# Altium project EmbeddedSystem_Project.PrjPcb (part 2 of 2)
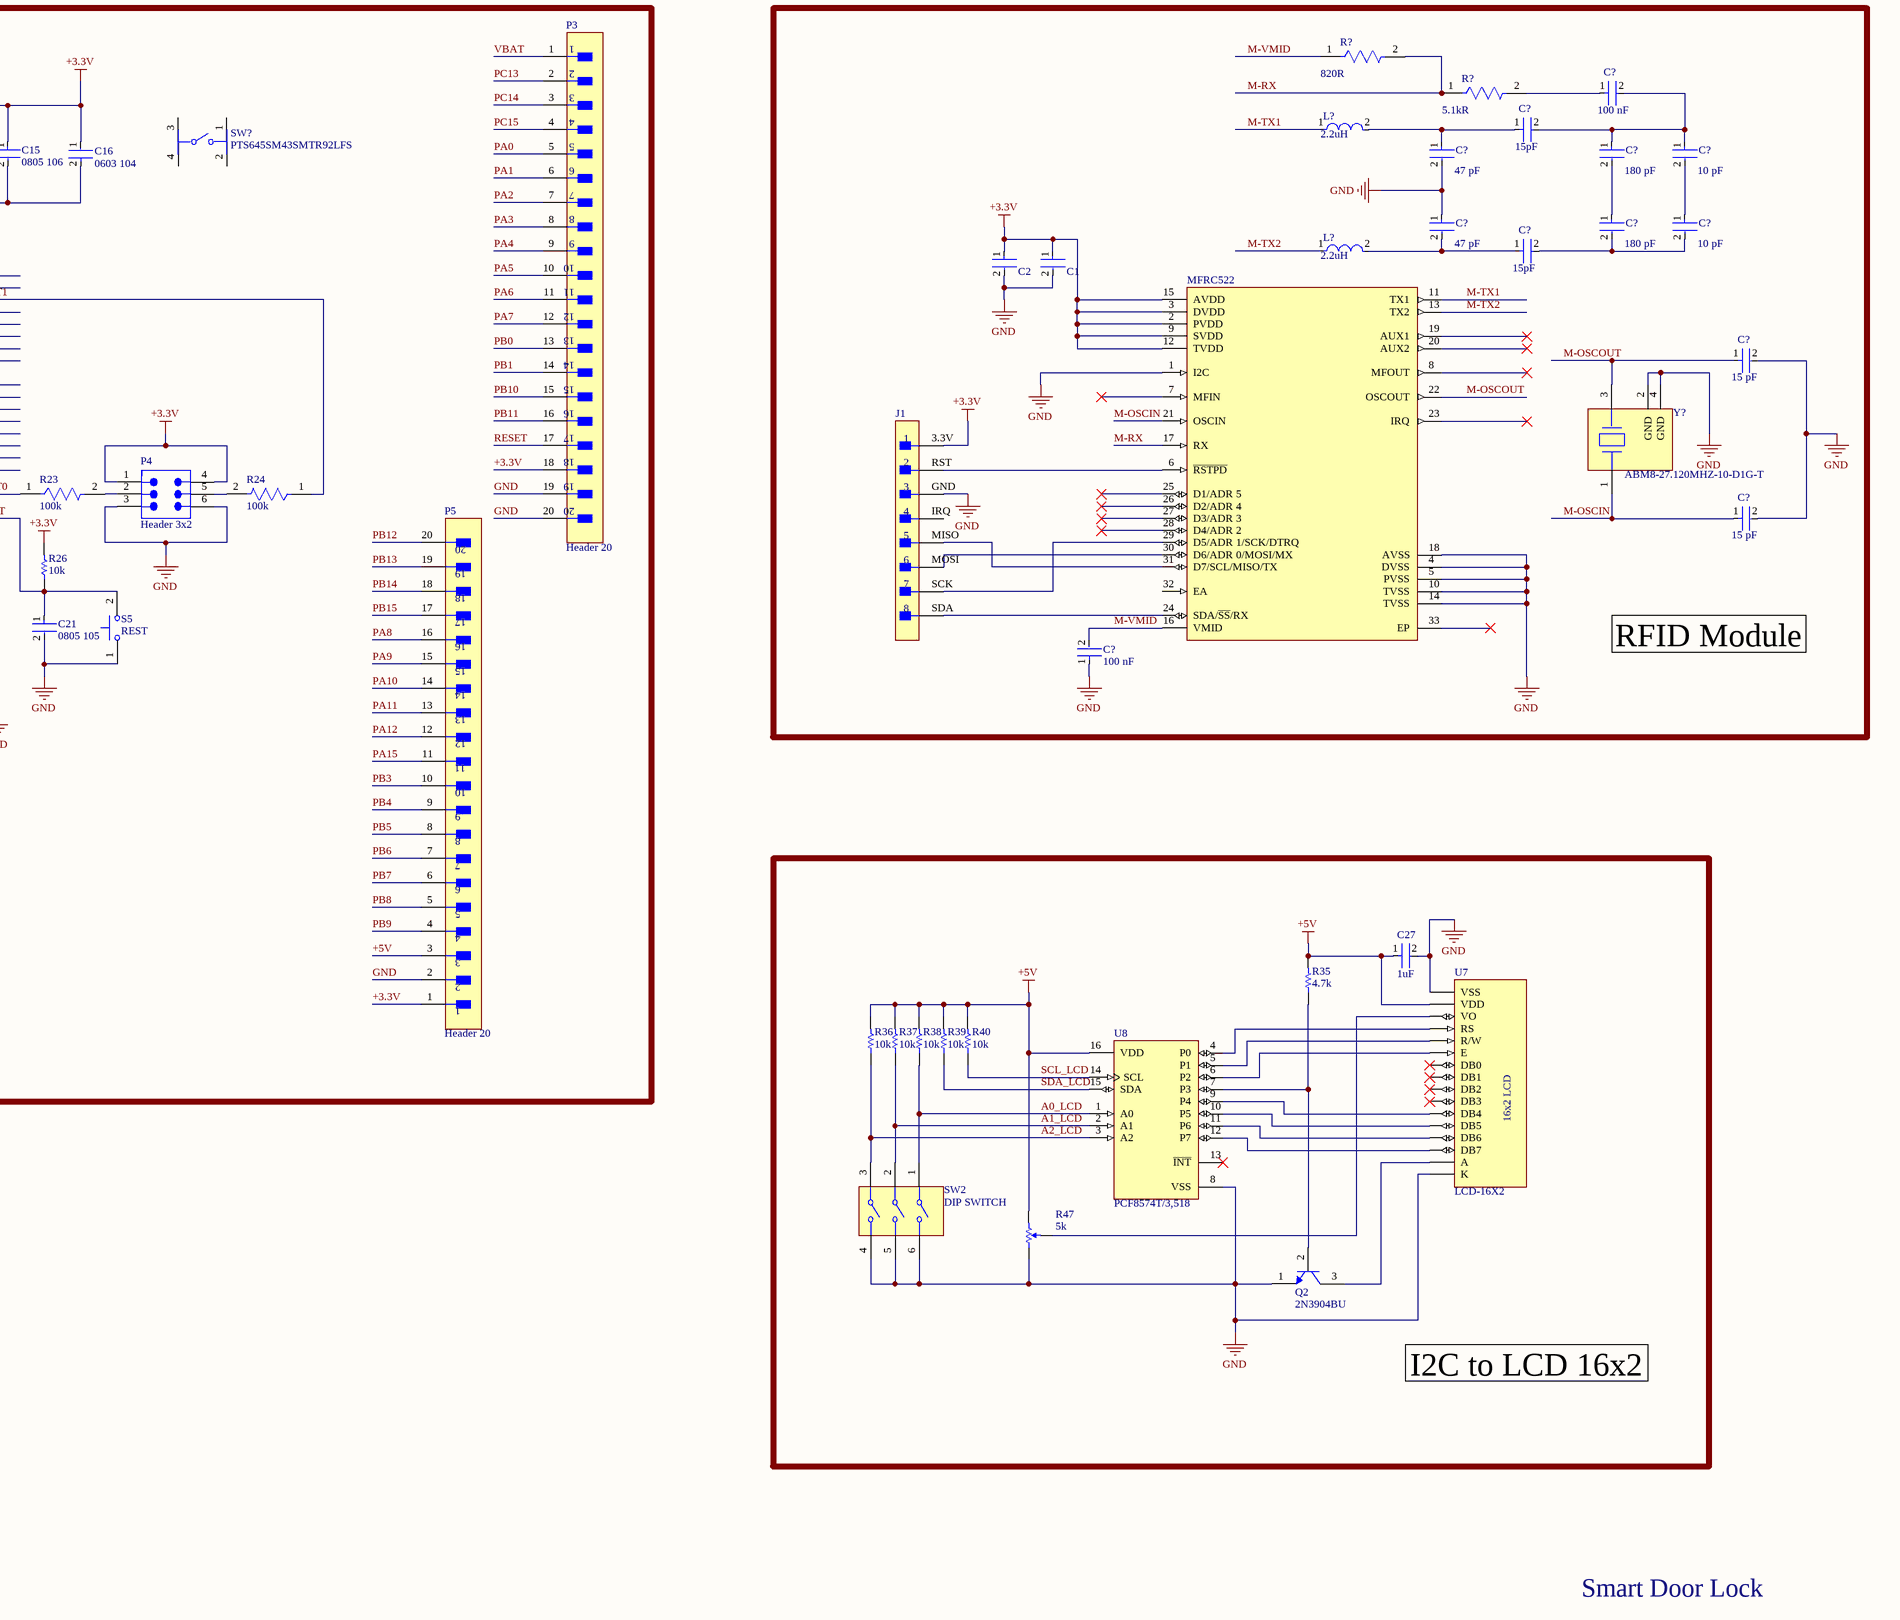
[diagram p4: Schematic.SchDoc, bottom right]

## Sheet Schematic.SchDoc (continued)

### Library data of the parts
C1 C2 = 11868f565c42a9108669ba33697ecf6: CAP CER 1UF 25V X7R 0805; Manufacturer: Yageo; Material: Ceramic; Tolerance: 0.1; Capacitance: 1 uF; Temperature Characteristic: X7R; RoHS: TRUE; Manufacturer Part Number: CC0805KKX7R8BB105; Value: 1 uF; Package: CC0805-0.85; Ipc Land Pattern Name: CAPC200125X85; Device Class L2: Capacitors; ComponentLink2URL: http://www.yageo.com/documents/recent/UPY-GPHC_Y5V_6.3V-to-50V_8.pdf; Height: 0.95mm; ComponentLink2Description: Datasheet; Voltage Rating: 25 V; Automotive: No; Device Class L1: Passive Components; Lead Free: Yes; Temperature Range Low: -30°C; Digikey Description: CAP CER 1UF 25V X7R 0805; Temperature: -30°C to +85°C; Temperature Range High: +85°C; Category: Cap; Device Class L3: Ceramic Capacitors; Footprint Url: http://www.yageo.com/exep/pages/download/literatures/UPY-C_GEN_24.pdf; Octopart: https://octopart.com/cc0805kkx7r8bb105-yageo-42244645; Mouser Description: Multilayer Ceramic Capacitor, CC Series, 1 - F, - 10%, X7R, 25 V, 0805 [2012 Metric]
C3 C12 C21 C27 = 11868f565c42a9108669ba33697ecf6: CAP CER 1UF 25V X7R 0805; Manufacturer Part Number: CC0805KKX7R8BB105; Manufacturer: Yageo; Material: Ceramic; Tolerance: 0.1; Capacitance: 1 uF; Temperature Characteristic: X7R; RoHS: TRUE; Value: 1 uF; Package: CC0805-0.85; Ipc Land Pattern Name: CAPC200125X85; Device Class L2: Capacitors; ComponentLink2URL: http://www.yageo.com/documents/recent/UPY-GPHC_Y5V_6.3V-to-50V_8.pdf; Height: 0.95mm; ComponentLink2Description: Datasheet; Voltage Rating: 25 V; Automotive: No; Device Class L1: Passive Components; Lead Free: Yes; Temperature Range Low: -30°C; Digikey Description: CAP CER 1UF 25V X7R 0805; Temperature: -30°C to +85°C; Temperature Range High: +85°C; Category: Cap; Device Class L3: Ceramic Capacitors; Footprint Url: http://www.yageo.com/exep/pages/download/literatures/UPY-C_GEN_24.pdf; Octopart: https://octopart.com/cc0805kkx7r8bb105-yageo-42244645; Mouser Description: Multilayer Ceramic Capacitor, CC Series, 1 - F, - 10%, X7R, 25 V, 0805 [2012 Metric]
C13 C16 C23-C26 = 236180d848d6139a670b325ea6854c9: Multilayer Ceramic Capacitors 100nF ±20% 50V X7R SMD 0603; Length: 1.6mm; Mount: Surface Mount; Package Quantity: 1; Construction: Flat; Case/Package: 0603; Max Operating Temperature: 125°C; Case Code (Metric): 1608; Radiation Hardening: No; Packaging: Tape and Reel; Tolerance: 20%; Case Code (Imperial): 0603; Lead Free: Lead Free; Voltage Rating: 50V; Depth: 0.8mm; Width: 0.031inch; Thickness: 0.037inch; RoHS Compliant: Yes; Height: 0.8mm; Capacitance: 100nF; Dielectric: X7R; REACH SVHC: No SVHC; Min Operating Temperature: -55°C; Weight: 7.1E-05oz; Termination: SMD/SMT; Series: C; Dielectric Material: Ceramic; Voltage Rating (DC): 50V; Number of Pins: 2; Resistor Type: Ceramic
C14 C17 = 11868f565c42a9108669ba33697ecf6_1: CAP CER 0.022UF 50V X7R 0603; Dielectric Material: Ceramic; Insulation Resistance: 100GR; Tolerance: 10%; Capacitance: 22nF; Thickness: 0.035inch; Case/Package: 0603; Packaging: Tape and Reel; Voltage Rating (DC): 50V; Length: 1.6mm; Depth: 0.8mm; Dielectric: X7R; Resistor Type: Ceramic; Min Operating Temperature: -55°C; Number of Pins: 2; Series: CC; Mount: Surface Mount; Max Operating Temperature: 125°C; Case Code (Imperial): 0603; Width: 0.031inch; Halogen Free: Halogen Free; Lead Free: Lead Free; Voltage: 50V; RoHS Compliant: Yes; Package Quantity: 1; Height: 0.8mm; REACH SVHC: No SVHC; Voltage Rating: 50V; Case Code (Metric): 1608; Termination: SMD/SMT; Radiation Hardening: No
C15 = 02cd4be3c70576c341d710602a673aa: General Purpose Ceramic Capacitor, 0805, 10uF, 10%, X5R, 15%, 10V; Packaging: Tape and Reel; Mount: Surface Mount; Length: 2.01mm; Series: -; Dielectric Material: Ceramic; Voltage Rating: 10V; Tolerance: 10%; Voltage Rating (DC): 10V; Termination: SMD/SMT; Number of Pins: 2; Thickness: 0.055inch; Min Operating Temperature: -55°C; REACH SVHC: No SVHC; Width: 0.049inch; Case/Package: 0805; Capacitance: 10uF; Depth: 1.25mm; Height: 1.4mm; Voltage: 10V; Package Quantity: 3000; Lead Free: Lead Free; Case Code (Metric): 2012; Construction: Flat; RoHS Compliant: Yes; Case Code (Imperial): 0805; Dielectric: X5R; Max Operating Temperature: 85°C; Radiation Hardening: No
C18-C20 C22 = b4654b650e69147ec39a6b967a45e02: CAP CER 20PF 50V 5% NP0 0603; Manufacturer Part Number: C0603C200J5GACTU; Manufacturer: KEMET; Temperature Coefficient: 30ppm/°C; Temperature Characteristic: C0G; Automotive Grade: Grade 1; Tolerance: 0.05; Material: Ceramic; Category: Cap; Temperature Range Low: -55°C; RoHS: TRUE; ComponentLink2URL: https://api.kemet.com/component-edge/download/datasheet/C0603C100J5GACAUTO.pdf; Package: C0603C-CF; Height: 0.87mm; Capacitance: 20 pF; Voltage Rating: 50 V; Octopart: https://octopart.com/c0603c200j5gactu-kemet-9138585; Device Class L1: Passive Components; Automotive: Yes; Digikey Description: CAP CER 20PF 50V 5% NP0 0603; Temperature Range High: +125°C; Device Class L3: Ceramic Capacitors; Mouser Description: Multilayer Ceramic Capacitors MLCC - SMD/SMT 50volts 20pF C0G 5%; ComponentLink2Description: Datasheet; Device Class L2: Capacitors; Lead Free: Yes; Temperature: -55°C to +125°C; Value: 20 pF
C28 C29 = CMP-2008-02046-2: CAP CER 0.1UF 10V X5R 0402; Manufacturer: Kemet; Manufacturer Part Number: C0402C104K8PACTU; Material: Ceramic; Capacitance: 0.10 μF; Temperature Coefficient: 15%; Tolerance: 0.1; Value: 0.10 μF; Package: C0402-BB; Temperature: -55°C to +125°C; ComponentLink2Description: Datasheet; Temperature Characteristic: X5R; Device Class L1: Passive Components; Height: 0.55mm; Lead Free: Yes; ComponentLink2URL: https://content.kemet.com/datasheets/KEM_C1002_X7R_SMD.pdf; Device Class L2: Capacitors; Temperature Range Low: -55°C; Temperature Range High: +125°C; RoHS: TRUE; Octopart: https://octopart.com/c0402c104k8pactu-kemet-140039; Automotive: No; Mouser Description: Capacitor 100 nF 10 VDC 0402; Category: Cap; Voltage Rating: 10 V; Digikey Description: CAP CER 0.1UF 10V X5R 0402; Ipc Land Pattern Name: CAPC10050X50; Device Class L3: Ceramic Capacitors
C?#1 C?#12 = CMP-03422-001169-1: CAP CER 0.1UF 6.3V X5R 0201; Manufacturer: Yageo; Material: Ceramic; Temperature Coefficient: 15%; Tolerance: 0.2; Height: 0.33mm; Manufacturer Part Number: CC0201MRX5R5BB104; Temperature Range High: +85°C; Temperature: -55°C to +85°C; Mouser Description: Multilayer Ceramic Capacitors MLCC - SMD/SMT 100nF 6.3V X5R 20%; Footprint Url: http://www.yageo.com/exep/pages/download/literatures/UPY-C_GEN_24.pdf; Package: CC0201-BA; ComponentLink2Description: Datasheet; Octopart: https://octopart.com/cc0201mrx5r5bb104-yageo-33242267; RoHS: TRUE; Device Class L3: Ceramic Capacitors; Lead Free: Yes; Voltage Rating: 6.3 V; Digikey Description: CAP CER 0.1UF 6.3V X5R 0201; Temperature Range Low: -55°C; ComponentLink2URL: http://www.yageo.com/documents/recent/UPY-GPHC_X5R_4V-to-50V_25.pdf; Automotive: No; Capacitance: 100 nF; Category: Cap; Device Class L1: Passive Components; Temperature Characteristic: X5R; Ipc Land Pattern Name: CAPC6030X30; Device Class L2: Capacitors
C?#2 C?#9 = CMP-03422-001493-1: CAP CER 15PF 50V C0G/NPO 0603; Insulation Resistance: 100GR; Tolerance: 5%; Dielectric: C0G; Dielectric Material: Ceramic; Series: CC; Height: 0.8mm; Number of Pins: 2; Max Operating Temperature: 125°C; Width: 0.031inch; Length: 1.6mm; Mount: Surface Mount; Packaging: Tape and Reel; RoHS Compliant: Yes; Radiation Hardening: No; Voltage Rating: 50V; Min Operating Temperature: -55°C; Case Code (Imperial): 0603; Case Code (Metric): 1608; Termination: SMD/SMT; Lead Free: Lead Free; Depth: 0.8mm; Package Quantity: 1; Thickness: 0.035inch; Case/Package: 0603; REACH SVHC: No SVHC
C?#3 C?#6 = CMP-2007-00435-2: CAP CER 47PF 50V C0G/NP0 0805; Manufacturer: KEMET; Temperature Characteristic: C0G; Material: Ceramic; Temperature Coefficient: 30ppm/°C; Tolerance: 0.05; Temperature Range High: +125°C; Device Class L1: Passive Components; Device Class L3: Ceramic Capacitors; Lead Free: Yes; Manufacturer Part Number: C0805C470J5GACTU; Temperature: -55°C to +125°C; Height: 0.88mm; Octopart: https://octopart.com/c0805c470j5gactu-kemet-150274; RoHS: TRUE; Category: Cap; Voltage Rating: 50 V; Automotive: No; Device Class L2: Capacitors; Value: 47 pF; Ipc Land Pattern Name: CAPC200125X78; Temperature Range Low: -55°C; Mouser Description: Multilayer Ceramic Capacitors MLCC - SMD/SMT 50volts 47pF C0G 5%; Package: C0805C-DN; Digikey Description: CAP CER 47PF 50V C0G/NP0 0805; ComponentLink2URL: https://content.kemet.com/datasheets/KEM_C1003_C0G_SMD.pdf; ComponentLink2Description: Datasheet
C?#4 C?#7 = CMP-2007-00307-2: CAP CER 180PF 50V C0G/NP0 0805; Manufacturer: KEMET; Temperature Characteristic: C0G; Temperature Coefficient: 30ppm/°C; Tolerance: 0.05; Material: Ceramic; ComponentLink2Description: Datasheet; Automotive: No; Temperature Range High: +125°C; Digikey Description: CAP CER 180PF 50V C0G/NP0 0805; Octopart: https://octopart.com/c0805c181j5gactu-kemet-108653; Device Class L2: Capacitors; ComponentLink2URL: https://content.kemet.com/datasheets/KEM_C1003_C0G_SMD.pdf; RoHS: TRUE; Manufacturer Part Number: C0805C181J5GACTU; Device Class L3: Ceramic Capacitors; Voltage Rating: 50 V; Lead Free: Yes; Package: C0805C-DN; Temperature Range Low: -55°C; Capacitance: 180 pF; Ipc Land Pattern Name: CAPC200125X78; Mouser Description: Multilayer Ceramic Capacitors MLCC - SMD/SMT 50volts 180pF C0G 5%; Temperature: -55°C to +125°C; Category: Cap; Height: 0.88mm; Device Class L1: Passive Components
C?#5 C?#8 = CMP-2008-03404-2: Multilayer Ceramic Capacitor, C Series, 10 Pf, - 5%, C0G / Np0, 50 V, 0402 [1005 Metric] Rohs Compliant: Yes; Manufacturer: Kemet; Temperature Coefficient: 15%; Voltage Rating: 50 V; Value: 10 pF; Tolerance: 0.05; Automotive: No; Temperature Range High: +125°C; ComponentLink2Description: Datasheet; Manufacturer Part Number: C0402C100J5GACTU; Material: Ceramic; Lead Free: Yes; ComponentLink2URL: https://content.kemet.com/datasheets/KEM_C1002_X7R_SMD.pdf; Device Class L3: Ceramic Capacitors; RoHS: TRUE; Package: C0402-BB; Temperature: -55°C to +125°C; Temperature Range Low: -55°C; Height: 0.55mm; Mouser Description: Multilayer Ceramic Capacitor, C Series, 10 Pf, - 5%, C0G / Np0, 50 V, 0402 [1005 Metric] Rohs Compliant: Yes; Octopart: https://octopart.com/c0402c100j5gactu-kemet-108448; Digikey Description: Multilayer Ceramic Capacitor, C Series, 10 Pf, - 5%, C0G / Np0, 50 V, 0402 [1005 Metric] Rohs Compliant: Yes; Temperature Characteristic: C0G; Category: Cap; Ipc Land Pattern Name: CAPC10050X50; Device Class L1: Passive Components; Device Class L2: Capacitors
C?#10 C?#11 = CMP-1037-00805-2: 1206 C 15pF Ceramic Multilayer Capacitor; 50 VDC; +125degC; C0G Dielec; +/-5%; Manufacturer: KEMET; Tolerance: 0.05; Temperature Coefficient: 15%; Automotive Grade: Grade 0; Voltage Rating: 50 V; Temperature Range High: +150°C; Temperature Characteristic: C0G; Device Class L1: Passive Components; Automotive: Yes; Device Class L2: Capacitors; Digikey Description: 1206 C 15pF Ceramic Multilayer Capacitor; 50 VDC; +125degC; C0G Dielec; +/-5%; Height: 0.88mm; RoHS: TRUE; Package: C1206C-EB; Temperature Range Low: -55°C; Mouser Description: Multilayer Ceramic Capacitors MLCC - SMD/SMT 50volts 15pF C0G 5%; Lead Free: Yes; ComponentLink2Description: Datasheet; Ipc Land Pattern Name: CAPC320160X78; Octopart: https://octopart.com/c1206c150j5gactu-kemet-138585; Temperature: -55°C to +150°C; Material: Ceramic; Capacitance: 15 pF; ComponentLink2URL: https://content.kemet.com/datasheets/KEM_C1007_X8R_ULTRA_150C_SMD.pdf; Device Class L3: Ceramic Capacitors; Manufacturer Part Number: C1206C150J5GACTU; Category: Cap
D1 D2 = 8706943c75ba83719d021d2fdc84c58_1: NexarPartId: 549908; Illumination Color: Red; Lens Transparency: Clear; Luminous Intensity: 54mcd; Current: 2A; Forward Current: 20mA; Number of Elements: 1; Power Rating: 75mW; Lens Color: Colorless; Wavelength: 639nm; Viewing Angle: 130°; Voltage: 2V; Dominant Wavelength: 631nm; Reverse Voltage: 5V; Height: 550µm; Length: 1.6mm; Number of Pins: 2; Packaging: Tape and Reel; Mount: Surface Mount; Case Code (Metric): 1608; Radiation Hardening: No; Case Code (Imperial): 0603; Test Current: 20mA; Number of LEDs: 1; Schedule B: 8541402000, 8541402000; Lead Free: Lead Free; Power Dissipation: 75mW; RoHS: Compliant; Forward Voltage: 2V; Lens Style: Clear; Color: Red; Max Operating Temperature: 85°C; Depth: 800µm; Width: 800µm; Min Operating Temperature: -55°C; Case/Package: 0603
D3 = CMP-2000-05199-2: NexarPartId: 549908; Illumination Color: Red; Lens Transparency: Clear; Luminous Intensity: 54mcd; Current: 2A; Forward Current: 20mA; Number of Elements: 1; Power Rating: 75mW; Lens Color: Colorless; Wavelength: 639nm; Viewing Angle: 130°; Voltage: 2V; Dominant Wavelength: 631nm; Reverse Voltage: 5V; Height: 550µm; Length: 1.6mm; Number of Pins: 2; Packaging: Tape and Reel; Mount: Surface Mount; Case Code (Metric): 1608; Radiation Hardening: No; Case Code (Imperial): 0603; Test Current: 20mA; Number of LEDs: 1; Schedule B: 8541402000, 8541402000; Lead Free: Lead Free; Power Dissipation: 75mW; RoHS: Compliant; Forward Voltage: 2V; Lens Style: Clear; Color: Red; Max Operating Temperature: 85°C; Depth: 800µm; Width: 800µm; Min Operating Temperature: -55°C; Case/Package: 0603
D4 D8 D10 = 8706943c75ba83719d021d2fdc84c58: LED GREEN CLEAR CHIP SMD; Dominant Wavelength: 569nm; Reverse Voltage: 5V; Lens Color: Colorless; Viewing Angle: 130°; Voltage: 2V; Forward Current: 30mA; Power Dissipation: 100mW; Luminous Intensity: 6mcd; Number of LEDs: 1; Forward Voltage: 2.1V; Wavelength: 565nm; Test Current: 10mA; Min Operating Temperature: -55°C; Lens Style: Clear; Mount: Surface Mount; Width: 0.8mm; Packaging: Tape and Reel; Lens Transparency: Clear; Case Code (Metric): 1608; Depth: 0.8mm; Case Code (Imperial): 0603; Case/Package: 0603; Number of Pins: 2; Max Operating Temperature: 85°C; Lead Free: Lead Free; Number of Elements: 1; Length: 1.6mm; Height: 0.8mm; Package Quantity: 1; Power Rating: 100mW; Radiation Hardening: No; Illumination Color: Green; Color: Green
D5 = CMP-123542-000001-1: Rectifier diode 1000 V 1 A DO-41, ,; Manufacturer: Diotec; Max Surge Forward Current: 27A; Forward Current: 1A; Max Junction Temp: +175°C; Reverse Voltage: 1000V; Value: 15pF; Peak Reverse Current: 5uA; Category: Diode; Temperature Range Low: -50°C; Automotive: No; Temperature: -50°C to +175°C; Lead Free: Yes; ComponentLink2Description: Datasheet; Max Repetitive Reverse Voltage: 1000V; ComponentLink2URL: https://datasheet.octopart.com/1N4007-Diotec-datasheet-62346875.pdf; Manufacturer Part Number: 1N4007; Device Class L3: Rectifier Diodes; Height: 2.8mm; Octopart: https://octopart.com/1n4007-diotec-4040411; Package: 1N4007; Temperature Range High: +175°C; Device Class L1: Discrete Semiconductors; Device Class L2: Diodes; RoHS: TRUE; Capacitance: 15pF; Ipc Land Pattern Name: DIOAD888W100L520D280
D6 D7 = CMP-22017-000005-2: LED GREEN CLEAR CHIP SMD; Dominant Wavelength: 569nm; Reverse Voltage: 5V; Lens Color: Colorless; Viewing Angle: 130°; Voltage: 2V; Forward Current: 30mA; Power Dissipation: 100mW; Luminous Intensity: 6mcd; Number of LEDs: 1; Forward Voltage: 2.1V; Wavelength: 565nm; Test Current: 10mA; Min Operating Temperature: -55°C; Lens Style: Clear; Mount: Surface Mount; Width: 0.8mm; Packaging: Tape and Reel; Lens Transparency: Clear; Case Code (Metric): 1608; Depth: 0.8mm; Case Code (Imperial): 0603; Case/Package: 0603; Number of Pins: 2; Max Operating Temperature: 85°C; Lead Free: Lead Free; Number of Elements: 1; Length: 1.6mm; Height: 0.8mm; Package Quantity: 1; Power Rating: 100mW; Radiation Hardening: No; Illumination Color: Green; Color: Green
J1 = 46342ca634edb1a761f196181bcfdd6: Conn Shrouded Header (4 Sides) HDR 8 POS 1.25mm Solder ST Top Entry Thru-Hole PicoBlade Tray; Manufacturer Lifecycle Status: ACTIVE; Gender: Male; Glow Wire Compliant: Non-compliant; Current Rating: 1A; Number of Positions: 8; Contact Resistance: 20mΩ; Insulation Resistance: 100MΩ; Plating: Tin; Voltage Rating (DC): 125V; Number of Circuits: 7; Schedule B: 8536694040, 8536694040; Max Operating Temperature: 85°C; Housing Material: Polyamide; Pitch: 1.25mm; Number of Rows: 1; ComponentLink1URL: http://molex.com; Country of Origin: MX; Case/Package: 0810; Height: 4.4mm; Housing Color: Natural; Flammability Rating: UL94 V-0; Orientation: Vertical; ComponentLink3Description: Manufacturer's Package Drawing; Mount: Through Hole; Min Operating Temperature: -40°C; Number of Pins: 8; Radiation Hardening: No; Contact Plating: Tin; Lead Pitch: 1.25mm; China RoHS: Compliant; ComponentLink1Description: Manufacturer's Website; Lead Free: Lead Free; ComponentLink2Description: Datasheet URL; RoHS: Compliant; Voltage Rating (AC): 125V; ComponentLink3URL: https://www.molex.com/content/dam/molex/molex-dot-com/products/automated/en-us/salesdrawingpdf/530/53047/530470810_sd.pdf?inline; Color: Natural; Number of Contacts: 8; Lifecycle Status: Production; HelpURL: https://www.molex.com/en-us/products/part-detail/530470810#part-details; ComponentLink2URL: https://www.molex.com/en-us/products/part-detail/530470810#part-details; REACH SVHC: Unknown; Contact Material: Tin; Termination: Through Hole; Voltage Rating: 125V
J2 = CMP-00671-05399696-1: M20-9990445 Conn Unshrouded Header HDR 4 POS 2.54mm Solder ST Thru-Hole Bulk/Loose; Insulation Resistance: 10GΩ; Connector Type: Male Pin; Voltage Rating (DC): 750V; Max Current Rating: 3A; Contact Resistance: 25mΩ; Number of Contacts: 4; Gender: Male; Color: Black; Height: 2.54mm; Contact Material: Brass, Bronze, Gold, Nickel; Orientation: Straight; Width: 12.7mm; Mount: Through Hole; Pitch: 2.54mm; Lead Pitch: 2.54mm; RoHS: Compliant; Max Operating Temperature: 105°C; Case/Package: SIL; NexarPartId: 5399696; Depth: 2.54mm; Length: 10.16mm; Current Rating: 3A; Contact Plating: Gold; Radiation Hardening: No; Contact Mating Length: 6.096mm; Voltage Rating (AC): 750V; Termination: Solder; REACH SVHC: No SVHC; Weight: 45.359237g; Number of Rows: 1; Min Operating Temperature: -40°C; Housing Material: Nylon; Housing Color: Black; Number of Positions: 4; Number of Pins: 4
J5 = f2cb566baf1c37ab5a3b8e90bbeafd6: 26-61-4060 3.96mm (.156") Pitch KK® Solid Header, Vertical, Friction Lock, 6 Circuits, Gold (Au) Plating; Manufacturer Lifecycle Status: ACTIVE; NexarPartId: 277947; Glow Wire Compliant: Non-compliant; Gender: Male; Number of Positions: 6; Insulation Resistance: 50GΩ; Voltage Rating: 250V; Current Rating: 7A; Contact Resistance: 6mΩ; Packaging: Bulk; Contact Plating: Gold; Lifecycle Status: Production; Number of Rows: 1; Mount: Through Hole; Height: 14.73mm; Min Operating Temperature: 0°C; Pitch: 3.96mm; Termination: Solder; Orientation: Vertical; Length: 23.62mm; Lead Pitch: 3.96mm; Country of Origin: US; Number of Contacts: 6; Depth: 10.01mm; Contact Material: Brass; Housing Material: Polyester; Housing Color: Natural; Flammability Rating: UL94 V-0; Voltage Rating (DC): 250V; Max Operating Temperature: 75°C; Radiation Hardening: No; Schedule B: 8536694040; Lead Free: Lead Free; Max Current Rating: 7A; REACH SVHC: Unknown; Number of Circuits: 6; Max Voltage Rating (AC): 250V; RoHS: Compliant
K1 = CMP-007-000000-1: 5V Trigger Relay Module For Arduino And Raspberry Pi 5V Trigger Relay Module For Arduino And Raspberry Pi; MF: Songle Relay; Component Type: Standard; Value: *; MP: SRD-05VDC-SL-C; Package: NON STANDARD-5 Songle Relay; Pin Count: 5; SnapEDA_Link: https://www.snapeda.com/parts/SRD-05VDC-SL-C/Songle+Relay/view-part/?ref=snap; Price: None; Source: SRD-05VDC-SL-C.SchLib; Availability: Not in stock; Design Item ID: SRD-05VDC-SL-C; Check_prices: https://www.snapeda.com/parts/SRD-05VDC-SL-C/Songle+Relay/view-part/?ref=eda
L?#1 L?#2 = CMP-02424-000562-1: Commercial Inductors, High Saturation Series 2.2uH 6.5A 34mΩ 20%; Saturation Current: 14A; Self Resonant Frequency: 5MHz; Core Material: Metal; DC Resistance (DCR): 34mR; Shielding: Shielded; Test Frequency: 100kHz; Mount: Surface Mount; Contact Plating: Tin; Inductance Tolerance: 20%; Depth: 6.72mm; Width: 0.255inch; Max DC Current: 6.5A; Height - Seated (Max): 0.094inch; Max Operating Temperature: 125°C; Case Code (Metric): 6363; RMS Current (Irms): 6.5A; Lead Free: Lead Free; Current Rating: 6.5A; Min Operating Temperature: -55°C; Package Quantity: 2000; Case/Package: 2525; Radiation Hardening: No; Military Standard: Not; Termination: SMD/SMT; Length: 7.24mm; Case Code (Imperial): 2525; Height: 2.4mm; Number of Pins: 2525; Packaging: Tape and Reel; Tolerance: 20%
MFRC522 = 3a6c802cd46f4f197358bd66f1506a1: IC RFID READER 13.56MHZ 32HVQFN; Manufacturer: NXP; Nominal Supply Current: 3-60mA; Interface: I2C,SPI,UART,RS-232; Max Supply Voltage: 3.6V; Max Junction Temp: +100°C; Standoff Height: 0mm; Data Rate: 10Mbits/s; Min Supply Voltage: 1.6V; Max Power Dissipation: 200mW; Digikey Description: IC RFID READER 13.56MHZ 32HVQFN; Manufacturer Part Number: MFRC52202HN1,151; ComponentLink2URL: https://www.nxp.com/docs/en/data-sheet/MFRC522.pdf; Temperature Range High: +100°C; ComponentLink2Description: Datasheet; Category: IC; Device Class L1: Integrated Circuits (ICs); Device Class L3: Transceivers; Max Frequency: 13.56MHz; Automotive: No; Height: 1mm; Ambient Temperature Range High: +85°C; Temperature: to +100°C; Lead Free: Yes; Mouser Description: RFID Transponders CONTACTLESS READER IC; Device Class L2: RF Semiconductors and Devices; Octopart: https://octopart.com/mfrc52202hn1%2C151-nxp+semiconductors-19647932; Footprint Url: https://www.nxp.com/docs/en/package-information/SOT617-1.pdf; RoHS: TRUE; Package: SOT617-1; Ambient Temperature Range Low: -25°C
P1 P2 = CMP-2000-05242-1: Male Header, Pitch 2.54 mm, 1 x 3 Position, Height 8.18 mm, Tail Length 3.56 mm, RoHS, Bulk; Current Rating: 4A; Brand: Molex; Pitch: 2.54mm; Voltage Rating: 250V; Mounting Angle: Vertical; Type: Locking; Factory Pack Quantity: 16000; Tradename: KK; Housing Material: Nylon; Contact Material: Brass; Manufacturer URL: http://www.molex.com/; Termination Style: ThroughHole; Mounting Style: ThroughHole; Number of Positions: 3Position; Contact Gender: Pin(Male); Packaging: Bulk; Series: 6373; Datasheet Version: Sep-01; Contact Plating: Tin; Product: Headers; Datasheet URL: https://datasheet.ciiva.com/19472/232274-19472863.pdf; RoHS: Details; Product Category: Headers&WireHousings; Manufacturer: Molex; Number of Rows: 1Row
P3 P5 = CMP-00257-00250569-1: 90325-0020 Picoflex PF-50 Header, Vertical, Low Profile, with PCB Pegs, 20 Circuits; Manufacturer Lifecycle Status: ACTIVE; NexarPartId: 250569; Voltage Rating (AC): 250V; Number of Circuits: 20; Current Rating: 1.2A; Gender: Male; Pitch: 1.27mm; Glow Wire Compliant: Non-compliant; Contact Resistance: 15mΩ; Wire/Cable Gauge: 26AWG; Width: 24.13mm; Number of Pins: 20; Termination: Through Hole; Material: Polyester; Length: 9.32mm; Housing Material: Polyester; Min Operating Temperature: -40°C; Height: 6.4mm; Voltage Rating: 250V; Contact Material: Brass; REACH SVHC: Unknown; Lead Pitch: 1.27mm; Number of Poles: 20; Schedule B: 8536694040; Mount: Through Hole; Number of Positions: 20; Housing Color: Black; Contact Plating: Tin; Country of Origin: MY; Working Voltage: 250V; Max Current Rating: 1.2A; Lifecycle Status: Production; Lead Free: Lead Free; Number of Rows: 1; Flammability Rating: UL94 V-0; Voltage Rating (DC): 250V; Number of Contacts: 20; RoHS: Compliant; Max Operating Temperature: 105°C; Color: Black; Depth: 5.98mm; Orientation: Vertical
P4 = CMP-1502-00530-2: NexarPartId: 8917590; Insulation Resistance: 1GΩ; Current Rating: 8A; Insulation: Insulated; Voltage Rating: 600V; Gender: Male; Connector Type: Male Pin, Socket; Pitch: 4.2mm; Number of Contacts: 6; Row Spacing: 5.5118mm; Contact Resistance: 10mΩ; Max Operating Temperature: 105°C; Width: 13.9mm; Min Operating Temperature: -40°C; Mount: Through Hole; REACH SVHC: Unknown; Number of Rows: 2; Contact Material: Copper, Nickel; Contact Gender: Male; Fastening Type: Ramp; Number of Positions: 6; Color: White; Housing Material: Nylon; Flammability Rating: UL94 V-0; RoHS: Compliant; Operating Supply Voltage: 600V; Lead Pitch: 4.2mm; Number of Pins: 6; Termination: Through Hole; Length: 13.8mm; Contact Plating: Tin; Height: 12.8mm
Q1 = CMP-1031-00019-1: Plastic Medium-Power, Complementary Silicon Transistor, 3-Pin TO-220, Pb-Free, Tube; Manufacturer: On Semiconductor; hFE Max (k): 20; IC Continuous (A): 8; Polarity: NPN; ComponentLink3Description: Package Specification; ComponentLink2URL: http://www.onsemi.cn/pub_link/Collateral/TIP100-D.PDF; Mounting Technology: Through Hole; PackageDescription: 3-Pin Flange Mount, Vertical Straight Lead, Body 9.97 x 4.445 mm, Pitch 2.54 mm; ComponentLink1URL: http://www.onsemi.com/; PackageReference: TO-220-3-221A-09; RoHS: TRUE; ComponentLink1Description: Manufacturer URL; PartNumber: TIP102G; Packing: Tube; ComponentLink2Description: Datasheet; PackageVersion: Rev. AG, 09/2011; DatasheetVersion: Rev. 13; ComponentLink3URL: http://www.onsemi.com/pub_link/Collateral/221A-09.PDF
Q2 = CMP-2000-04944-1: NPN General-Purpose Amplifier, 40 V VCEO, 0.2 A, -55 to 150 degC, 2-Pin TO-92, RoHS, Bulk; Manufacturer: FairchildSemiconductor; Maximum Collector Base Voltage: 60V; Minimum DC Current Gain: 40@0.1mA@1V; Maximum Collector Emitter Voltage: 40V; Maximum DC Collector Current: 0.2A; Rad Hard: No; Maximum Operating Frequency: 300(Min)MHz; Maximum Collector Emitter Saturation Voltage: 0.2@1mA@10mA; Maximum Power Dissipation: 625mW; Package Description: 3-Pin Transistor Outline Package, Body Dia 4.79 mm, Pitch 1.27 mm; Package Reference: TO-92; Pin Count: 3; Operating Temperature: -55to150degC; Category: GPBJT; Manufacturer URL: https://www.fairchildsemi.com/; Datasheet URL: https://datasheet.ciiva.com/4722/2n3904-82270-4722369.pdf; Package: 3TO-92; Packaging: Bulk; Type: NPN; Datasheet Version: Rev. 1.1.0, 10/2014; Mounting: ThroughHole
R1 R6 R26 = CMP-1659-00013-4: Chip Resistor, 10 KOhm, +/- 1%, 0.125 W, -55 to 155 degC, 0805 (2012 Metric), RoHS, Tape and Reel; Manufacturer: Yageo; Voltage Rating: 150 V; Mount: Surface Mount; ComponentLink1Description: Manufacturer URL; ComponentLink2URL: http://www.yageo.com/documents/recent/PYu-RC_Group_51_RoHS_L_04.pdf; Pins: 2; Length: 2 mm; Min Operating Temperature: -55 degC; Height: 0.5 mm; Mounting Technology: Surface Mount; RoHSCompliant: true; REACH SVHC: No SVHC; ComponentLink1URL: http://www.yageo.com/; Max Operating Temperature: 155 degC; PackageReference: 0805; DatasheetVersion: Rev. 4, 02/2016; Package Quantity: 5000; Packaging: Tape and Reel; ComponentLink2Description: Datasheet; PackageDescription: 2-Pin Surface Mounted Device, Body 2 x 1.25 mm
R2 R5 = CMP-2000-03159-1: Manufacturer: Vishay Dale; Part Number: CRCW06032K00FKEA
R3 R15-R17 R42 R44 = RES-2: Chip Resistor, 1 KOhm, +/- 1%, 125 mW, -55 to 155 degC, 0805 (2012 Metric), RoHS, Tape and Reel; Manufacturer: Yageo; Temperature Coefficient: 100ppm/degreesC; Voltage Rating (DC): 150V; Max Power Dissipation: 125mW; Resistance: 1KOhm; Number of Pins: 2; Number of Terminations: 2; Datasheet URL: http://www.yageo.com/NewPortal/yageodocoutput?fileName=/pdf/R-Chip/PYu-RC_Group_51_RoHS_L_5.pdf; Length: 0.079inch; Package Description: 2-Pin Surface Mounted Device, Body 2 x 1.25 mm; Depth: 1.25mm; Height: 0.024inch; Military Standard: Not; Case/Package: 0805; Package Reference: 0805; RoHSCompliant: true; Lead Free: LeadFree; Packaging: TapeandReel; Package Quantity: 1; Datasheet Version: Rev. 5, 10/2016; Tolerance: 1%; Min Operating Temperature: -55degC; Voltage Rating: 150V; Composition: ThickFilm; Case Code (Imperial): 0805; Power Rating: 125mW; Width: 0.049inch; Case Code (Metric): 2012; Manufacturer URL: http://www.yageo.com/; Max Operating Temperature: 155degC; REACH SVHC: Unknown; Termination: SMD/SMT
R4 = CMP-2000-02988-1: Manufacturer: Vishay Dale; Part Number: CRCW06031K30FKEA
R12 R13 R35 = RES-2_1: Chip Resistor, 4.7 KOhm, +/- 1%, 0.1 W, -55 to 155 degC, 0603 (1608 Metric), RoHS, Tape and Reel; Manufacturer: Yageo; Power Rating: 100mW; Temperature Coefficient: 100PPM/C; Resistance: 4.7kOhms; Voltage Rating: 50V; Package Reference: 0603; Series: RC; Datasheet Version: Rev. 7, 05/2017; Packaging: Reel; Termination Style: SMD/SMT; Datasheet URL: http://www.yageo.com/documents/recent/PYu-RC_Group_51_RoHS_L_7.pdf; Manufacturer URL: http://www.yageo.com/; Package Description: 2-Pin Surface Mount Device, Body 1.6 x 0.8 mm; Case Code - mm: 1608; Case Code - in: 0603; Mounting Technology: SurfaceMount; Operating Temperature Range: -55Cto+155C; Tolerance: 1%; Product: ThickFilmResistorsGeneralPurpose
R18 R19 = CMP-2000-03439-1: Part Number: CRCW0603510RFKEA; Manufacturer: Vishay Dale
R20 = CMP-2000-06942-1: Chip Resistor, 4.7 KOhm, +/- 1%, 0.1 W, -55 to 155 degC, 0603 (1608 Metric), RoHS, Tape and Reel; Manufacturer: Yageo; Power Rating: 100mW; Temperature Coefficient: 100PPM/C; Resistance: 4.7kOhms; Voltage Rating: 50V; Package Reference: 0603; Series: RC; Datasheet Version: Rev. 7, 05/2017; Packaging: Reel; Termination Style: SMD/SMT; Datasheet URL: http://www.yageo.com/documents/recent/PYu-RC_Group_51_RoHS_L_7.pdf; Manufacturer URL: http://www.yageo.com/; Package Description: 2-Pin Surface Mount Device, Body 1.6 x 0.8 mm; Case Code - mm: 1608; Case Code - in: 0603; Mounting Technology: SurfaceMount; Operating Temperature Range: -55Cto+155C; Tolerance: 1%; Product: ThickFilmResistorsGeneralPurpose
R21 R22 = CMP-28537-000732-1: Automotive Metal Thin Film Chip Resistor, 0402, 20kΩ, 0.1%, 10ppm/°C, 0.0625W, 75V; Power Rating: 30mW; Resistance: 20kR; Max Power Dissipation: 63mW; Voltage Rating: 25V; Resistor Type: Thin Film; RoHS Compliant: Yes; Number of Terminations: 2; Tolerance: 0.1%; Features: Automotive AEC-Q200; Case Code (Imperial): 0402; Package Quantity: 5000; Case/Package: 0402; Lead Free: Lead Free; Voltage Rating (DC): 25V; Series: RG; Termination: SMD/SMT; Length: 1mm; Max Operating Temperature: 155°C; Height: 0.35mm; Width: 0.5mm; Case Code (Metric): 1005; Packaging: Tape and Reel; Min Operating Temperature: -55°C; Temperature Coefficient: 10ppm/°C
R23 R24 = CMP-2000-04816-3: RES 100KΩ 1.00% 0.1W 0603; Temperature Coefficient: 100ppm/°C; Voltage Rating: 50V; Max Power Dissipation: 100mW; Tolerance: 1%; Working Voltage: 75V; Resistance: 100kR; Min Operating Temperature: -55°C; Case Code (Imperial): 0603; Width: 0.031inch; Max Operating Temperature: 155°C; Military Standard: Not; Technology: THICK FILM; Ratings: AEC-Q200; Features: Moisture Resistant; Construction: Rectangular; Resistor Type: Thick Film; RoHS Compliant: Yes; Case Code (Metric): 1608; Termination: SMD/SMT; Series: AC; Lead Free: Lead Free; Length: 1.6mm; Depth: 0.8mm; Height: 0.022inch; Power Rating: 100mW; Package Quantity: 1; Packaging: Tape and Reel; Case/Package: 0603; Number of Terminations: 2; Moisture Sensitivity Level: 1
R25 = CMP-2000-00700-2: RES SMD 0 OHM JUMPER 1/10W 0603; Manufacturer Part Number: ERJ-3GEY0R00V; Manufacturer: Panasonic; Tolerance: 5%; Automotive Grade: Grade 0; Voltage Rating: 75V; Value: 0Ω; Temperature Coefficient: -100/+600ppm/°C; Power Rating: 0.1W; Mouser Description: Resistor, Chip Thick Film, 0 Ohm, 0.1w, Resistor, Chip Thick Film, 0 Ohm, 0.1w, 5%; Ipc Land Pattern Name: RESC16080X45; Category: Res; Package: 0603; Temperature: -55°C to +155°C; Temperature Range Low: -55°C; Series: ERJ; Resistance: 0Ω; RoHS: TRUE; Composition: Thick Film; Octopart: https://octopart.com/erj-3gey0r00v-panasonic-55389238; Device Class L1: Passive Components; Footprint Url: https://industrial.panasonic.com/cdbs/www-data/pdf/RDA0000/DMA0000COL17.pdf; ComponentLink2Description: Datasheet; Device Class L2: Resistors; Temperature Range High: +155°C; Digikey Description: RES SMD 0 OHM JUMPER 1/10W 0603; Lead Free: Yes; Device Class L3: Chip SMD Resistors; Height: 0.55mm; ComponentLink2URL: https://industrial.panasonic.com/cdbs/www-data/pdf/RDA0000/AOA0000C301.pdf; Automotive: Yes
R27 = CMP-1012-00849-3: RES SMD 1M OHM 1% 1/10W 0603; Resistance: 1MR; Voltage Rating: 75V; Temperature Coefficient: 100ppm/°C; Power Rating: 100mW; REACH SVHC: No SVHC; Radiation Hardening: No; Features: Automotive AEC-Q200; Case Code (Metric): 1608; Resistance Tolerance: 1%; Case/Package: 0603; Termination: SMD/SMT; Max Operating Temperature: 155°C; Tolerance: 1%; Size Code: 0603; Case Code (Imperial): 0603; Min Operating Temperature: -55°C; Number of Pins: 2; Mount: Surface Mount; Package Quantity: 1; Military Standard: Not; Voltage Rating (DC): 75V; Depth: 0.8mm; Packaging: Tape and Reel; Width: 0.8mm; Number of Terminations: 2; Length: 1.6mm; Height: 0.022inch; RoHS Compliant: Yes; Resistor Type: Thick Film; Contact Plating: Tin; Lead Free: Lead Free; Series: ERJ; Construction: Rectangular; Max Power Dissipation: 100mW
R36-R41 R43 R48 = CMP-2000-05022-1: Resistor, 10 KOhm, +/- 5%, 100 mW, -55 to 155 degC, 0603 (1608 Metric), RoHS, Tape and Reel; Manufacturer: Yageo; Resistance: 10kOhms; Voltage Rating: 50V; Temperature Coefficient: 100PPM/C; Power Rating: 100mW; Package Reference: 603; Series: RC; Case Code - mm: 1608; Packaging: Reel; Datasheet URL: http://www.farnell.com/datasheets/443971.pdf; Datasheet Version: Rev. 4, 04/2009; Operating Temperature Range: -55Cto+155C; Product: ThickFilmResistorsGeneralPurpose; Package Description: 2-Pin Surface Mount Device, Body 1.6 x 0.8 mm; Manufacturer URL: http://www.yageo.com/; Case Code - in: 0603; Tolerance: 5%; Termination Style: SMD/SMT
R47 = CMP-2000-05579-1: 3214 - 5-Turn Trimpot(R) Trimming Potentiometer, 5 KOhm, +/- 10%, 0.25 W, -65 to 150 degC, RoHS, Tape and Reel; Manufacturer: Bourns; Temperature Coefficient: ±100ppm/°C; Power Rating: 250mW; No. of Turns: 5; Track Resistance: 5kohm; SVHC: NoSVHC(16-Jun-2014); Potentiometer Mounting: SMD; Manufacturer URL: http://www.bourns.com/; Resistance Tolerance: ±10%; Datasheet URL: http://www.bourns.com/docs/Product-Datasheets/3214.pdf; ROHS COMPLIANT: Yes; Mounting Technology: SurfaceMount; Datasheet Version: 05/2016; Package Reference: 3214W; Package Description: 3-Pin Surface Mount Device, Body 3.5 x 4.8 mm, Pitch 1.25 mm
R?#1 = CMP-2001-04130-2: RES Thick Film, 820Ω, 1%, 0.125W, 100ppm/°C, 0805; Max Power Dissipation: 125mW; Voltage Rating: 150V; Termination: SMD/SMT; Features: Automotive AEC-Q200; Tolerance: 1%; Radiation Hardening: No; Max Operating Temperature: 155°C; Case Code (Imperial): 0805; Composition: Thick Film; Weight: 0.000194oz; Temperature Coefficient: 100ppm/°C; Voltage Rating (DC): 150V; Power Rating: 125mW; Package Quantity: 10; Min Operating Temperature: -55°C; Contact Plating: Tin; Length: 2mm; Military Standard: Not; Height: 0.45mm; Case/Package: 0805; Lead Free: Lead Free; Number of Terminations: 2; Width: 1.25mm; Depth: 1.25mm; Packaging: Tape and Reel; Case Code (Metric): 2012
R?#2 = CMP-2002-01158-2: RES SMD 5.1K OHM 1% 1/10W 0402; Voltage Rating: 50V; Temperature Coefficient: 100ppm/°C; Power Rating: 100mW; Min Operating Temperature: -55°C; Technology: THICK FILM; Military Standard: Not; Depth: 0.5mm; Contact Plating: Tin; Tolerance: 1%; Construction: Rectangular; Length: 1mm; Case/Package: 0402; Lead Free: Lead Free; RoHS Compliant: Yes; Termination: SMD/SMT; Height: 0.35mm; Max Operating Temperature: 155°C; Case Code (Imperial): 0402; Number of Terminations: 2; Packaging: Tape and Reel; Case Code (Metric): 1005; Width: 0.5mm; Max Power Dissipation: 100mW; Package Quantity: 10000; Resistance Tolerance: 1%; REACH SVHC: No SVHC; Mount: Surface Mount; Series: ERJ; Voltage Rating (DC): 50V; Weight: 2.8E-05oz; Resistor Type: Thick Film
S1-S4 S6-S17 = CMP-011-00014-1: SPST, Through Hole, 3.3 mm Push, Off-(ON), Straight Terminal, 5.08 mm Pitch, Push Button Switch; MF: Same Sky; Case/Package: None; Pins: 2; Component Type: Standard; MP: MPB01-1B33-S-D; SnapEDA_Link: https://www.snapeda.com/parts/MPB01-1B33-S-D/Same+Sky/view-part/?ref=snap; Value: *; Design Item ID: MPB01-1B33-S-D; Check_prices: https://www.snapeda.com/parts/MPB01-1B33-S-D/Same+Sky/view-part/?ref=eda; Source: MPB01-1B33-S-D.SchLib
S5 S18 S19 = CMP-011-00013-1: Tactile Switches MINI PUSH BUTTON SWITCH 2-PIN QTY. 4; MF: Gravitech; Design Item ID: BUTT-2; Purchase-URL: https://pricing.snapeda.com/search/part/BUTT-2/?ref=eda; Availability: In Stock; Component Type: Standard; Case/Package: None; Price: None; MP: BUTT-2; Pins: 2; Source: BUTT-2.SchLib; Value: *; SnapEDA_Link: https://www.snapeda.com/parts/BUTT-2/Gravitech/view-part/?ref=snap; Check_prices: https://www.snapeda.com/parts/BUTT-2/Gravitech/view-part/?ref=eda
SW2 = CMP-08827-000034-1: SWITCH SLIDE DIP SPST 25MA 24V; Contact Resistance: 200mR; Actuator Type: Slide (Standard); Pitch: 0.1inch; Mechanical Life: 1000Cycles; Number of Circuits: 3; Actuator Length: 0mm; Washable: Yes; Radiation Hardening: No; Package Quantity: 55; Throw Configuration: SPST; Case/Package: DIP; Contact Material: Gold; Packaging: Rail/Tube; Max Current Rating: 25mA; Max Voltage Rating (DC): 24V; Series: A6S-H; Max Operating Temperature: 70°C; Orientation: Straight; Contact Plating: Gold; Current Rating: 25mA; Mount: Surface Mount; Voltage Rating (DC): 24V; Termination: Gull Wing; Terminal Pitch: 2.54mm; Number of Positions: 3; Min Operating Temperature: -20°C; RoHS Compliant: Yes; Contact Current Rating: 25mA; Length: 0.337inch; Depth: 9.8mm; Electrical Life: 1000Cycles
SW3 = CMP-08625-000007-1: SWITCH REED SPST-NO 350MA 140V; Voltage Rating (AC): 200V; Contact Resistance: 100mR; Release Time: 0.2ms; Resistance: 0.1R; Operate Time: 0.6ms; Power Rating: 10W; Capacitance: 0.3pF; Throw Configuration: SPST; Max Current Rating: 500mA; Min Operating Temperature: -40°C; Mount: Axial; Packaging: Bulk; Max Voltage Rating (DC): 200V; Max Operating Temperature: 125°C; Lead Free: Lead Free; Radiation Hardening: No; Package Quantity: 100; Length: 1.59inch; RoHS Compliant: Yes; Termination: Axial; Series: MDSR-7
SW? = CMP-2000-05160-2: SWITCH TACTILE SPST-NO 0.05A 12V; Contact Resistance: 100mR; Throw Configuration: SPST; Illumination Type: Non-Illuminated; Mechanical Life: 100000Cycles; Current Rating: 50mA; Switch Function: Off-Mom; Actuator Length: 0.85mm; Actuator Material: Nylon; Actuator Type: Standard; Operating Force: 160gf; Min Operating Temperature: -20°C; REACH SVHC: No SVHC; Termination: Gull Wing; Case/Package: SMD/SMT; Packaging: Tape and Reel; Mount: Surface Mount; Voltage Rating (DC): 12V; Orientation: Straight; Lead Free: Lead Free; Contact Material: Silver; Color: Black; Max Current Rating: 50mA; Contact Plating: Silver; Depth: 9mm; Package Quantity: 1; Max Voltage Rating (DC): 12V; Length: 6mm; Max Operating Temperature: 60°C
U1 = CMP-005-000000-1: Bluetooth to Serial Port Module; MF: ITead Studio; Pin Count: 33; Source: HC-05.SchLib; Check_prices: https://www.snapeda.com/parts/HC-05/ITEAD/view-part/?ref=eda; SnapEDA_Link: https://www.snapeda.com/parts/HC-05/ITEAD/view-part/?ref=snap; MP: HC-05; Component Type: Standard; Package: Module ITead Studio; Design Item ID: HC-05; Value: *
U2 = CMP-06313-000002-1: IC EEPROM 256K I2C 1MHZ 8UDFN; Manufacturer: Microchip; Standoff Height: 0mm; Nominal Supply Current: 1-2mA; Frequency: 1000kHz; Memory Size: 256Kbits; Max Supply Voltage: 5.5V; Interface: I2C,2-Wire; Min Supply Voltage: 1.7V; Temperature Range Low: -40°C; Device Class L2: Memory; ComponentLink2Description: Datasheet; Device Class L1: Integrated Circuits (ICs); Temperature Range High: +85°C; Temperature: -40°C to +85°C; Digikey Description: IC EEPROM 256K I2C 1MHZ 8UDFN; RoHS: TRUE; Category: IC; Device Class L3: EEPROM; Height: 0.6mm; Manufacturer Part Number: AT24C256C-MAHL-T; Octopart: https://octopart.com/at24c256c-mahl-t-microchip-77757994; Automotive: No; Mouser Description: EEPROM Serial-2Wire 256K-bit 32K x 8 1.8V/2.5V/3.3V/5V Automotive 8-Pin UDFN EP T/R; ComponentLink2URL: https://ww1.microchip.com/downloads/en/DeviceDoc/AT24C256C-I2C-Compatible-Serial-EEPROM-256-Kbit-20006042A.pdf; Memory Type: EEPROM; Lead Free: Yes; Package: C04-21355-Q4B
U3 = RT9193-33GB: Linear Voltage Regulator IC Positive Fixed 1 Output 300mA TSOT-23-5; MF: Richtek USA; SnapEDA_Link: https://www.snapeda.com/parts/RT9193-33GB/Richtek+USA+Inc./view-part/?ref=snap; Package: SOT-23-5 Richtek; MP: RT9193-33GB; Check_prices: https://www.snapeda.com/parts/RT9193-33GB/Richtek+USA+Inc./view-part/?ref=eda; Purchase-URL: https://pricing.snapeda.com/search/part/RT9193-33GB/?ref=eda; Digi-Key_Part_Number: 1028-1014-2-ND; Value: *
U4 = MC-ARM-STM32F103X8_B-SQ48: ARM Cortex-M3 32-bit MCU, 64 KB Flash, 20 KB Internal RAM, 37 I/Os, 48-pin LQFP, -40 to 85 degC, Tray; Supply Voltage(Vcc) min (V): 2; Internal RAM Size (kB): 20; FLASH Size (Prog) (kB): 64; A/D Converter: 2x12-bit (10 Channel); I/Os (High Current): 37; Operating Frequency(F) (Processor speed) (MHz): 72; Core: ARM Cortex-M3; ComponentLink3Description: Package Specification; Mounting Technology: Surface Mount; PartNumber: STM32F103C8T6; PackageReference: LQFP48; Packing: Tray; ComponentLink3URL: http://www.st.com/st-web-ui/static/active/en/resource/technical/document/datasheet/DM00058181.pdf; DatasheetVersion: Rev. 16; ComponentLink1URL: http://www.st.com/web/en/home.html; PackageVersion: Rev. 6, 06/2013; ComponentLink2URL: http://www.st.com/st-web-ui/static/active/en/resource/technical/document/datasheet/CD00161566.pdf; ComponentLink1Description: Manufacturer URL; ComponentLink2Description: Datasheet; PackageDescription: 48-Pin Low Profile Quad Flat Package, 7 x 7 mm Body, 0.5 mm Pitch
U5 = CMP-1502-03253-2: NexarPartId: 19991173; Insulation Resistance: 1GΩ; Contact Resistance: 30mΩ; Number of Contacts: 5; Number of Ports: 1; Gender: Receptacle; Current Rating: 1A; Connector Type: USB; Voltage Rating: 30V; USB Standard: USB 2.0; Plating: Nickel; Max Operating Temperature: 105°C; Orientation: Horizontal; Height: 2.9mm; Termination: Solder; Min Operating Temperature: -40°C; Number of Pins: 5; Flammability Rating: UL94 V-0; Lead Free: Lead Free; Packaging: Tape and Reel; Contact Plating: Gold; RoHS: Compliant; Mount: Horizontal, Surface Mount; Color: Black; REACH SVHC: Unknown; Operating Supply Voltage: 30V; Contact Material: Copper; Number of Positions: 5; Length: 5.9mm
U7 = CMP-00030-00001-1: Display Development Tools 16x2 Black on Green Char LCD w Backlight; MF: Gravitech; MP: LCD-16X2; Design Item ID: LCD-16X2; Check_prices: https://www.snapeda.com/parts/LCD-16X2/Gravitech/view-part/?ref=eda; Case/Package: None; Pins: 16; Source: LCD-16X2.SchLib; Value: *; SnapEDA_Link: https://www.snapeda.com/parts/LCD-16X2/Gravitech/view-part/?ref=snap; Component Type: Standard
U8 = CMP-10112-000010-1: IC I/O EXPANDER I2C 8B 16SOIC; Manufacturer: NXP Semiconductors; Frequency: 100kHz; Max Supply Voltage: 6V; Standoff Height: 0.1mm; Nominal Supply Current: 40uA; Max Junction Temp: +125°C; Min Supply Voltage: 2.5V; Number Of I/Os: 8; Manufacturer Part Number: PCF8574T/3,518; Footprint Url: https://www.nxp.com/docs/en/package-information/SOT162-1.pdf; ComponentLink2URL: https://www.nxp.com/docs/en/data-sheet/PCF8574_PCF8574A.pdf; Automotive: No; Digikey Description: IC I/O EXPANDER I2C 8B 16SOIC; Mouser Description: PCF8574 Series 2.5 - 6V Remote 8-bit I/O Expander for I2C-bus - SOIC-16; Ipc Land Pattern Name: SOIC127P1032X265-16; Interface: I2C; Octopart: https://octopart.com/pcf8574t%2F3%2C518-nxp+semiconductors-10470852; Ambient Temperature Range Low: -40°C; Lead Free: Yes; Device Class L2: Interface ICs; Temperature Range High: +85°C; Device Class L1: Integrated Circuits (ICs); Package: SOT162-1; ComponentLink2Description: Datasheet; Device Class L3: I/O Expanders; Temperature: -40°C to +85°C; Ambient Temperature Range High: +85°C; Height: 2.65mm; Category: IC; RoHS: TRUE; Temperature Range Low: -40°C
U10 = CMP-12132-000003-1: IC VOLT COMPARATOR DUAL LP 8SOIC; Manufacturer: STMicroelectronics; Response Time: 1.3us; Min Supply Voltage: 2V; Input Offset Voltage: 1mV; Input Bias Current: 0.02uA; Max Dual Supply Voltage: 18V; Output Current Per Channel: 18mA; Max Junction Temp: +150°C; Standoff Height: 0.1mm; Number Of Channels: 2; Nominal Supply Current: 0.45-0.6mA; Voltage Gain: 200V/mV; Max Supply Voltage: 36V; Min Dual Supply Voltage: 1V; Ambient Temperature Range Low: 0°C; ComponentLink2Description: Datasheet; Lead Free: Yes; Device Class L3: Comparators; Device Class L2: Linear ICs; Manufacturer Part Number: LM393D; Digikey Description: IC VOLT COMPARATOR DUAL LP 8SOIC; Category: IC; Octopart: https://octopart.com/lm393d-stmicroelectronics-25832; Package: SO8; RoHS: TRUE; Footprint Url: https://www.st.com/resource/en/datasheet/stm8l001j3.pdf; Temperature Range Low: 0°C; Temperature Range High: +70°C; Mouser Description: Analog Comparators Lo-Pwr Dual Voltage; ComponentLink2URL: https://www.st.com/resource/en/datasheet/lm393.pdf; Automotive: No; Temperature: 0°C to +70°C; Height: 1.75mm; Device Class L1: Integrated Circuits (ICs); Ambient Temperature Range High: +70°C
X1 = XTAL_1-2-2: Low Profile Quartz Crystal, 8.0 MHz, 2-Pin SMD, RoHS, Tape and Reel; Brand: ECS; Tolerance: 30PPM; Case Height: 4.3mm; Frequency Stability: 50PPM; Case Length: 13.2mm; Case Width: 4.8mm; Load Capacitance: 18pF; Termination Style: SMD/SMT; Product Category: Crystals; Packaging: Reel; Package Reference: ECS-80-18-5PX-TR; Mounting Technology: SurfaceMount; Dimensions: 4.8mmWx13.2mmLx4.3mmH; Package Description: 2-Pin Surface Mount Device, Body 11.4 x 4.8 mm, Height 4.3 mm; Datasheet URL: https://www.ecsxtal.com/store/pdf/csm-7x.pdf; Datasheet Version: 05/2016; Frequency: 8MHz; Manufacturer: ECS; Factory Pack Quantity: 1000; Manufacturer URL: https://www.ecsxtal.com/; Type: SMDQuartzCrystals; Mounting Style: SMD/SMT; Package / Case: HC-49/US; Operating Temperature Range: -10Cto+70C; RoHS: Details; Series: CSM-7X
Y1 = CMP-27762-015607-1: Crystal 32.768kHz ±20ppm (Tol) 4pF 85kΩ 2-Pin SMD T/R; ESR (Equivalent Series Resistance): 85kR; Frequency Tolerance: 20ppm; Mount: Surface Mount; Load Capacitance: 4pF; Case/Package: SMD/SMT; Packaging: Cut Tape; Frequency: 32.768kHz; Series: ABS05W; Min Operating Temperature: -40°C; Max Operating Temperature: 125°C
Y? = CMP-27762-001624-1: Crystal 27.12MHz ±10ppm 10pF SMD-4 3.2mm x 2.5mm

## Sheet Notepad.SchDoc
size A; SheetNumber: 2; SheetTotal: 2